# Altium schematic sheet ControlBoard.SchDoc
size A4; SheetNumber: 1; SheetTotal: 1
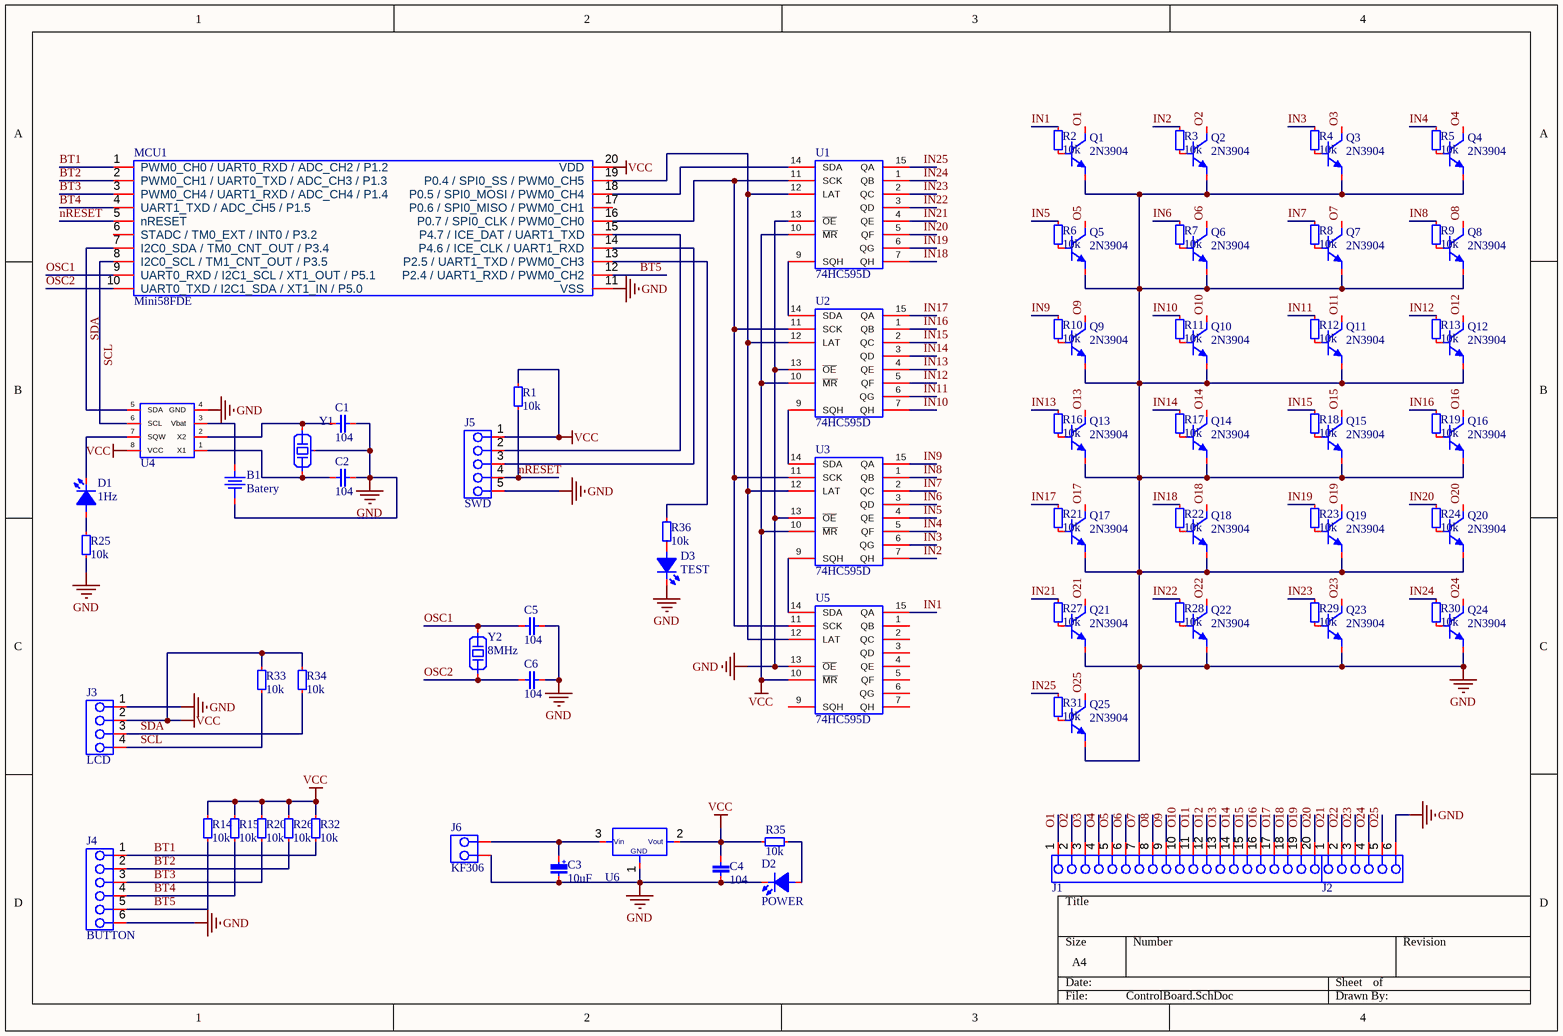
[diagram p0: ControlBoard.SchDoc]

## Parts
B1  Batery  [CR1220]
C1  104  [C0805]
C2  104  [C0805]
C3  10uF  [CAP_RAD_D06.3x11]
C4  104  [C0805]
C5  104  [C0805]
C6  104  [C0805]
D1  1Hz  [L0805RED]
D2  POWER  [L0805RED]
D3  TEST  [L0805RED]
J1  HEADER-FEMALE-2.54MM  [HEADER-FEMALE-20PINS-2.54MM]  (value not drawn)
J2  HEADER-FEMALE-2.54MM  [HEADER-FEMALE-06PINS-2.54MM]  (value not drawn)
J3  LCD  [HEADER-FEMALE-04PINS-2.54MM]
J4  BUTTON  [HEADER-FEMALE-06PINS-2.54MM]
J5  SWD  [HEADER-FEMALE-05PINS-2.54MM]
J6  KF306  [DG306-5.0-02P-12-00AH]
MCU1  Mini58FDE  [TSSOP20_0.65_4.4]
Q1  2N3904  [SOT23-3]
Q2  2N3904  [SOT23-3]
Q3  2N3904  [SOT23-3]
Q4  2N3904  [SOT23-3]
Q5  2N3904  [SOT23-3]
Q6  2N3904  [SOT23-3]
Q7  2N3904  [SOT23-3]
Q8  2N3904  [SOT23-3]
Q9  2N3904  [SOT23-3]
Q10  2N3904  [SOT23-3]
Q11  2N3904  [SOT23-3]
Q12  2N3904  [SOT23-3]
Q13  2N3904  [SOT23-3]
Q14  2N3904  [SOT23-3]
Q15  2N3904  [SOT23-3]
Q16  2N3904  [SOT23-3]
Q17  2N3904  [SOT23-3]
Q18  2N3904  [SOT23-3]
Q19  2N3904  [SOT23-3]
Q20  2N3904  [SOT23-3]
Q21  2N3904  [SOT23-3]
Q22  2N3904  [SOT23-3]
Q23  2N3904  [SOT23-3]
Q24  2N3904  [SOT23-3]
Q25  2N3904  [SOT23-3]
R1  10k  [R0805]
R2  10k  [R0805]
R3  10k  [R0805]
R4  10k  [R0805]
R5  10k  [R0805]
R6  10k  [R0805]
R7  10k  [R0805]
R8  10k  [R0805]
R9  10k  [R0805]
R10  10k  [R0805]
R11  10k  [R0805]
R12  10k  [R0805]
R13  10k  [R0805]
R14  10k  [R0805]
R15  10k  [R0805]
R16  10k  [R0805]
R17  10k  [R0805]
R18  10k  [R0805]
R19  10k  [R0805]
R20  10k  [R0805]
R21  10k  [R0805]
R22  10k  [R0805]
R23  10k  [R0805]
R24  10k  [R0805]
R25  10k  [R0805]
R26  10k  [R0805]
R27  10k  [R0805]
R28  10k  [R0805]
R29  10k  [R0805]
R30  10k  [R0805]
R31  10k  [R0805]
R32  10k  [R0805]
R33  10k  [R0805]
R34  10k  [R0805]
R35  10k  [R0805]
R36  10k  [R0805]
U1  74HC595D  [SO16]
U2  74HC595D  [SO16]
U3  74HC595D  [SO16]
U4  RealTime  [SOIC08_1.27_6.0]  (value not drawn)
U5  74HC595D  [SO16]
U6  AMS1117  [SOT223-3]  (value not drawn)
Y1  32.768KHz  [DT-26]  (value not drawn)
Y2  8MHz  [HC-49S]

## Nets
GND: B1.2 C1.2 C2.2 C3.2 C4.1 C5.2 C6.2 D2.2(K) D3.2(K) J2.6 J3.1 J4.6 J5.5 J6.2 MCU1.11(VSS) Q1.2(E) Q2.2(E) Q3.2(E) Q4.2(E) Q5.2(E) Q6.2(E) Q7.2(E) Q8.2(E) Q9.2(E) Q10.2(E) Q11.2(E) Q12.2(E) Q13.2(E) Q14.2(E) Q15.2(E) Q16.2(E) Q17.2(E) Q18.2(E) Q19.2(E) Q20.2(E) Q21.2(E) Q22.2(E) Q23.2(E) Q24.2(E) Q25.2(E) R25.1 U1.8 U1.13(~{OE}) U2.8 U2.13(~{OE}) U3.8 U3.13(~{OE}) U4.4(GND) U5.8 U5.13(~{OE}) U6.1 Y1.3(GND)
VCC: C4.2 J3.2 J5.1 MCU1.20(VDD) R1.2 R14.2 R15.2 R20.2 R26.2 R32.2 R33.2 R34.2 R35.1 U1.10(~{MR}) U1.16 U2.10(~{MR}) U2.16 U3.10(~{MR}) U3.16 U4.8(VCC) U5.10(~{MR}) U5.16 U6.2
BT1: J4.1 MCU1.1(PWM0_CH0_/_UART0_RXD_/_ADC_CH2_/_P1.2) R32.1
BT2: J4.2 MCU1.2(PWM0_CH1_/_UART0_TXD_/_ADC_CH3_/_P1.3) R26.1
BT3: J4.3 MCU1.3(PWM0_CH4_/_UART1_RXD_/_ADC_CH4_/_P1.4) R20.1
BT4: J4.4 MCU1.4(UART1_TXD_/_ADC_CH5_/_P1.5) R15.1
BT5: J4.5 MCU1.12(P2.4_/_UART1_RXD_/_PWM0_CH2) R14.1
IN1: R2.1 U5.15(QA)
IN2: R3.2 U3.7(QH)
IN3: R4.2 U3.6(QG)
IN4: R5.2 U3.5(QF)
IN5: R6.1 U3.4(QE)
IN6: R7.2 U3.3(QD)
IN7: R8.2 U3.2(QC)
IN8: R9.2 U3.1(QB)
IN9: R10.1 U3.15(QA)
IN10: R11.2 U2.7(QH)
IN11: R12.2 U2.6(QG)
IN12: R13.2 U2.5(QF)
IN13: R16.2 U2.4(QE)
IN14: R17.2 U2.3(QD)
IN15: R18.2 U2.2(QC)
IN16: R19.2 U2.1(QB)
IN17: R21.2 U2.15(QA)
IN18: R22.2 U1.7(QH)
IN19: R23.2 U1.6(QG)
IN20: R24.2 U1.5(QF)
IN21: R27.2 U1.4(QE)
IN22: R28.2 U1.3(QD)
IN23: R29.2 U1.2(QC)
IN24: R30.2 U1.1(QB)
IN25: R31.2 U1.15(QA)
nRESET: J5.4 MCU1.5(nRESET) R1.1
O1: J1.1 Q1.3(C)
O2: J1.2 Q2.3(C)
O3: J1.3 Q3.3(C)
O4: J1.4 Q4.3(C)
O5: J1.5 Q5.3(C)
O6: J1.6 Q6.3(C)
O7: J1.7 Q7.3(C)
O8: J1.8 Q8.3(C)
O9: J1.9 Q9.3(C)
O10: J1.10 Q10.3(C)
O11: J1.11 Q11.3(C)
O12: J1.12 Q12.3(C)
O13: J1.13 Q13.3(C)
O14: J1.14 Q14.3(C)
O15: J1.15 Q15.3(C)
O16: J1.16 Q16.3(C)
O17: J1.17 Q17.3(C)
O18: J1.18 Q18.3(C)
O19: J1.19 Q19.3(C)
O20: J1.20 Q20.3(C)
O21: J2.1 Q21.3(C)
O22: J2.2 Q22.3(C)
O23: J2.3 Q23.3(C)
O24: J2.4 Q24.3(C)
O25: J2.5 Q25.3(C)
OSC1: C5.1 MCU1.9(UART0_RXD_/_I2C1_SCL_/_XT1_OUT_/_P5.1) Y2.2
OSC2: C6.1 MCU1.10(UART0_TXD_/_I2C1_SDA_/_XT1_IN_/_P5.0) Y2.1
SCL: J3.4 MCU1.8(I2C0_SCL_/_TM1_CNT_OUT_/_P3.5) R33.1 U4.6(SCL)
SDA: J3.3 MCU1.7(I2C0_SDA_/_TM0_CNT_OUT_/_P3.4) R34.1 U4.5(SDA)
NetB1_1: B1.1 U4.3(Vbat)
NetC1_1: C1.1 U4.2(X2) Y1.2
NetC2_1: C2.1 U4.1(X1) Y1.1
NetC3_1: C3.1 J6.1 U6.3
NetD1_1: D1.1(A) R25.2
NetD1_2: D1.2(K) U4.7(SQW)
NetD2_1: D2.1(A) R35.2
NetD3_1: D3.1(A) R36.2
NetJ5_2: J5.2 MCU1.15(P4.7_/_ICE_DAT_/_UART1_TXD)
NetJ5_3: J5.3 MCU1.14(P4.6_/_ICE_CLK_/_UART1_RXD)
NetMCU1_13: MCU1.13(P2.5_/_UART1_TXD_/_PWM0_CH3) R36.1
NetMCU1_16: MCU1.16(P0.7_/_SPI0_CLK_/_PWM0_CH0) U1.11(SCK) U2.11(SCK) U3.11(SCK) U5.11(SCK)
NetMCU1_18: MCU1.18(P0.5_/_SPI0_MOSI_/_PWM0_CH4) U1.14(SDA)
NetMCU1_19: MCU1.19(P0.4_/_SPI0_SS_/_PWM0_CH5) U1.12(LAT) U2.12(LAT) U3.12(LAT) U5.12(LAT)
NetQ1_1: Q1.1(B) R2.2
NetQ2_1: Q2.1(B) R3.1
NetQ3_1: Q3.1(B) R4.1
NetQ4_1: Q4.1(B) R5.1
NetQ5_1: Q5.1(B) R6.2
NetQ6_1: Q6.1(B) R7.1
NetQ7_1: Q7.1(B) R8.1
NetQ8_1: Q8.1(B) R9.1
NetQ9_1: Q9.1(B) R10.2
NetQ10_1: Q10.1(B) R11.1
NetQ11_1: Q11.1(B) R12.1
NetQ12_1: Q12.1(B) R13.1
NetQ13_1: Q13.1(B) R16.1
NetQ14_1: Q14.1(B) R17.1
NetQ15_1: Q15.1(B) R18.1
NetQ16_1: Q16.1(B) R19.1
NetQ17_1: Q17.1(B) R21.1
NetQ18_1: Q18.1(B) R22.1
NetQ19_1: Q19.1(B) R23.1
NetQ20_1: Q20.1(B) R24.1
NetQ21_1: Q21.1(B) R27.1
NetQ22_1: Q22.1(B) R28.1
NetQ23_1: Q23.1(B) R29.1
NetQ24_1: Q24.1(B) R30.1
NetQ25_1: Q25.1(B) R31.1
NetU1_9: U1.9(SQH) U2.14(SDA)
NetU2_9: U2.9(SQH) U3.14(SDA)
NetU3_9: U3.9(SQH) U5.14(SDA)

Not connected (* = marked no-connect by the designer): MCU1 6(STADC_/_TM0_EXT_/_INT0_/_P3.2) 17(P0.6_/_SPI0_MISO_/_PWM0_CH1); U5 1(QB) 2(QC) 3(QD) 4(QE) 5(QF) 6(QG) 7(QH) 9(SQH)

## Notes on the sheet
- (in symbol Capacitor(Radian)) +
- (in symbol Ic-AMS1117(SOT-223)) Vin; Vout; GND

## Library data of the parts
C1 C2 C4-C6 = Capacitors(SMD)
C3 = Capacitor(Radian)
D1-D3 = LED0805
J1 = HEADER-FEMALE-20PINS-2.54MM
J2 J4 = HEADER-FEMALE-06PINS-2.54MM
J3 = HEADER-FEMALE-04PINS-2.54MM
J5 = HEADER-FEMALE-05PINS-2.54MM
J6 = DG306-5.0-02P-12-00AH
MCU1 = Mcu-Mini58FDE: Novoton 4Kb-RAM 32Kb-Flash
Q1-Q25 = Transistor-2N3904 (SOT-23)
R1-R36 = Resistors-SMD
U1-U3 U5 = Ic-74HC595D
U4 = RealTime-DS1307
U6 = Ic-AMS1117(SOT-223)
Y1 = Crystal 32.768KHz
Y2 = Crystal